# EAGLE schematic LED-Wiring (EAGLE 6.5.0)
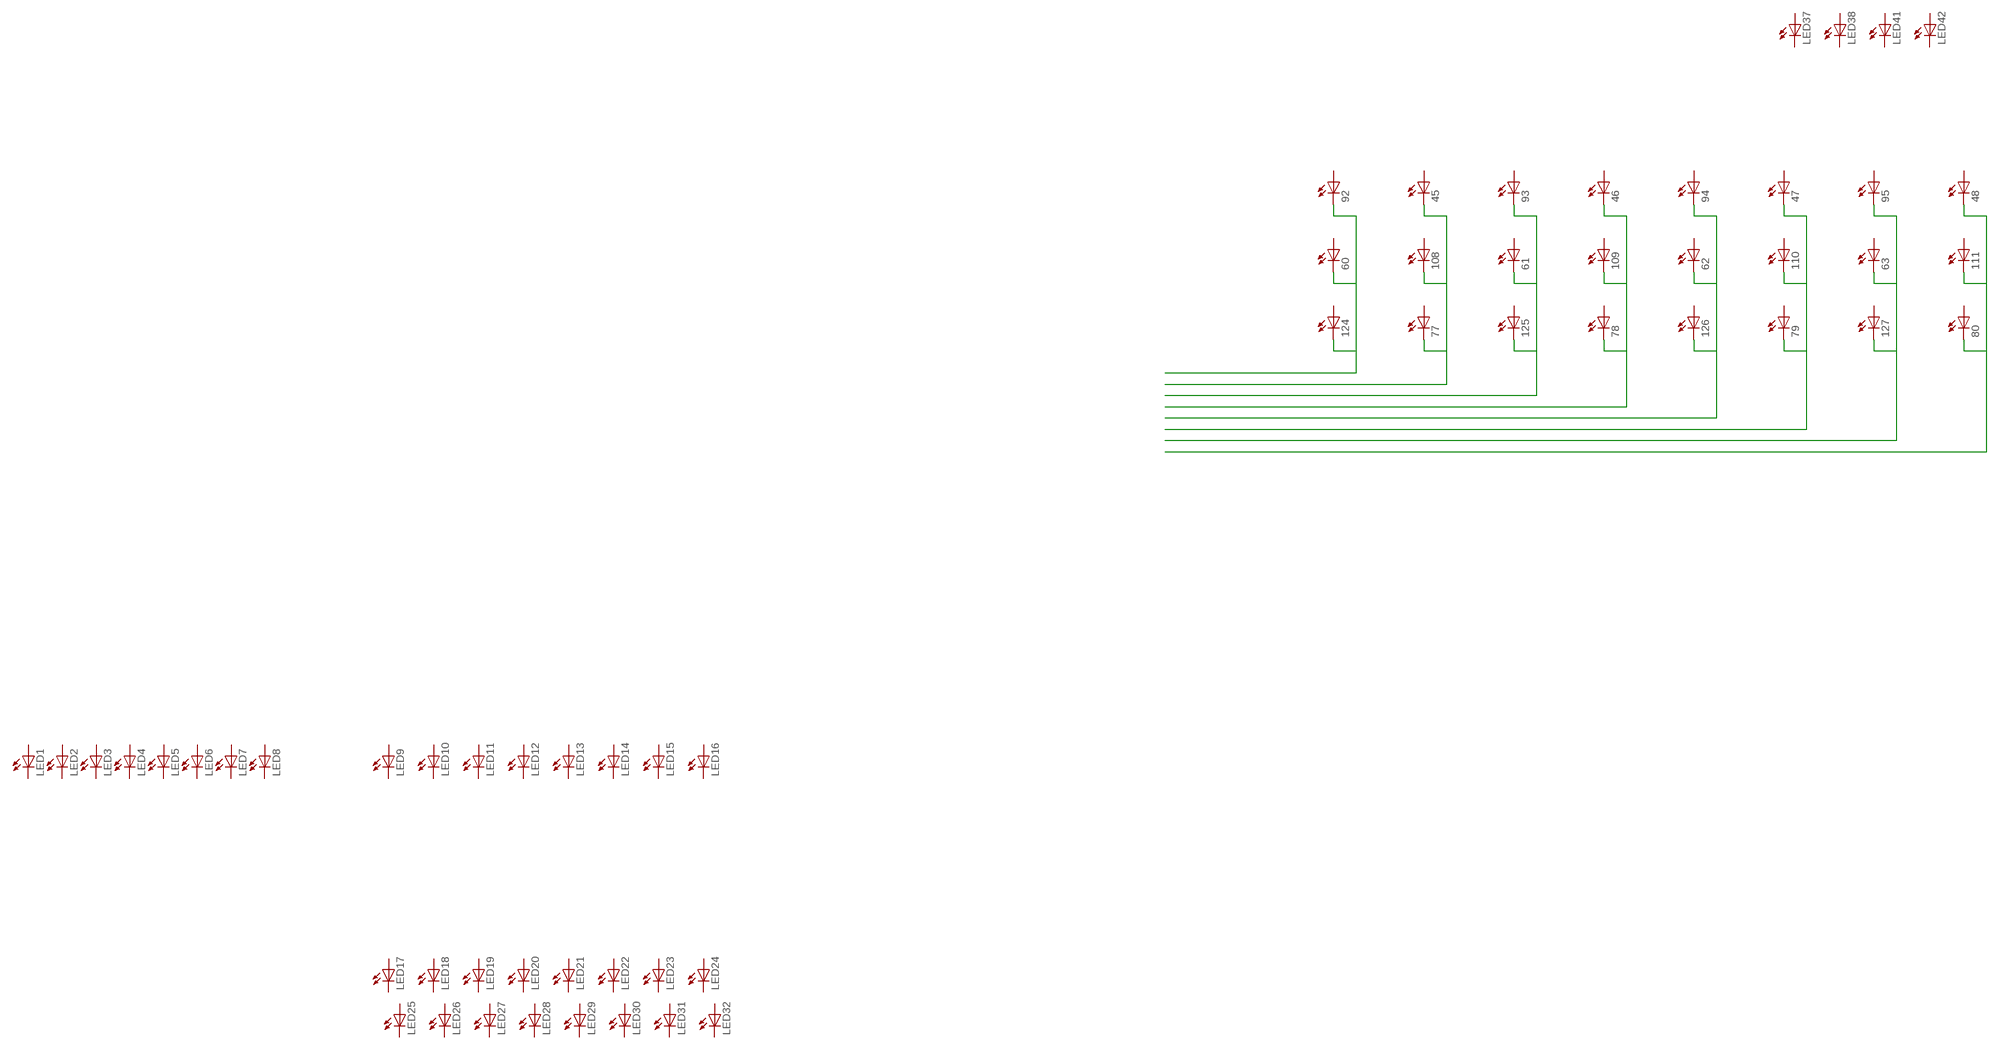
[diagram p0: schematic, sheet 1]

## Parts
45  LED  [SMARTLED-TTW]
46  LED  [SMARTLED-TTW]
47  LED  [SMARTLED-TTW]
48  LED  [SMARTLED-TTW]
60  LED  [SMARTLED-TTW]
61  LED  [SMARTLED-TTW]
62  LED  [SMARTLED-TTW]
63  LED  [SMARTLED-TTW]
77  LED  [SMARTLED-TTW]
78  LED  [SMARTLED-TTW]
79  LED  [SMARTLED-TTW]
80  LED  [SMARTLED-TTW]
92  LED  [SMARTLED-TTW]
93  LED  [SMARTLED-TTW]
94  LED  [SMARTLED-TTW]
95  LED  [SMARTLED-TTW]
108  LED  [SMARTLED-TTW]
109  LED  [SMARTLED-TTW]
110  LED  [SMARTLED-TTW]
111  LED  [SMARTLED-TTW]
124  LED  [SMARTLED-TTW]
125  LED  [SMARTLED-TTW]
126  LED  [SMARTLED-TTW]
127  LED  [SMARTLED-TTW]
LED1  LED  [SMARTLED-TTW]
LED2  LED  [SMARTLED-TTW]
LED3  LED  [SMARTLED-TTW]
LED4  LED  [SMARTLED-TTW]
LED5  LED  [SMARTLED-TTW]
LED6  LED  [SMARTLED-TTW]
LED7  LED  [SMARTLED-TTW]
LED8  LED  [SMARTLED-TTW]
LED9  LED  [SMARTLED-TTW]
LED10  LED  [SMARTLED-TTW]
LED11  LED  [SMARTLED-TTW]
LED12  LED  [SMARTLED-TTW]
LED13  LED  [SMARTLED-TTW]
LED14  LED  [SMARTLED-TTW]
LED15  LED  [SMARTLED-TTW]
LED16  LED  [SMARTLED-TTW]
LED17  LED  [SMARTLED-TTW]
LED18  LED  [SMARTLED-TTW]
LED19  LED  [SMARTLED-TTW]
LED20  LED  [SMARTLED-TTW]
LED21  LED  [SMARTLED-TTW]
LED22  LED  [SMARTLED-TTW]
LED23  LED  [SMARTLED-TTW]
LED24  LED  [SMARTLED-TTW]
LED25  LED  [SMARTLED-TTW]
LED26  LED  [SMARTLED-TTW]
LED27  LED  [SMARTLED-TTW]
LED28  LED  [SMARTLED-TTW]
LED29  LED  [SMARTLED-TTW]
LED30  LED  [SMARTLED-TTW]
LED31  LED  [SMARTLED-TTW]
LED32  LED  [SMARTLED-TTW]
LED37  LED  [SMARTLED-TTW]
LED38  LED  [SMARTLED-TTW]
LED41  LED  [SMARTLED-TTW]
LED42  LED  [SMARTLED-TTW]

## Nets
N$1: 60.C@1(C) 92.C@1(C) 124.C@1(C)
N$3: 45.C@1(C) 77.C@1(C) 108.C@1(C)
N$6: 61.C@1(C) 93.C@1(C) 125.C@1(C)
N$9: 46.C@1(C) 78.C@1(C) 109.C@1(C)
N$12: 62.C@1(C) 94.C@1(C) 126.C@1(C)
N$15: 47.C@1(C) 79.C@1(C) 110.C@1(C)
N$18: 63.C@1(C) 95.C@1(C) 127.C@1(C)
N$19: 48.C@1(C) 80.C@1(C) 111.C@1(C)
Unconnected: 45.A@1(A) 46.A@1(A) 47.A@1(A) 48.A@1(A) 60.A@1(A) 61.A@1(A) 62.A@1(A) 63.A@1(A) 77.A@1(A) 78.A@1(A) 79.A@1(A) 80.A@1(A) 92.A@1(A) 93.A@1(A) 94.A@1(A) 95.A@1(A) 108.A@1(A) 109.A@1(A) 110.A@1(A) 111.A@1(A) 124.A@1(A) 125.A@1(A) 126.A@1(A) 127.A@1(A) LED1.A@1(A) LED1.C@1(C) LED2.A@1(A) LED2.C@1(C) LED3.A@1(A) LED3.C@1(C) LED4.A@1(A) LED4.C@1(C) LED5.A@1(A) LED5.C@1(C) LED6.A@1(A) LED6.C@1(C) LED7.A@1(A) LED7.C@1(C) LED8.A@1(A) LED8.C@1(C) LED9.A@1(A) LED9.C@1(C) LED10.A@1(A) LED10.C@1(C) LED11.A@1(A) LED11.C@1(C) LED12.A@1(A) LED12.C@1(C) LED13.A@1(A) LED13.C@1(C) LED14.A@1(A) LED14.C@1(C) LED15.A@1(A) LED15.C@1(C) LED16.A@1(A) LED16.C@1(C) LED17.A@1(A) LED17.C@1(C) LED18.A@1(A) LED18.C@1(C) LED19.A@1(A) LED19.C@1(C) LED20.A@1(A) LED20.C@1(C) LED21.A@1(A) LED21.C@1(C) LED22.A@1(A) LED22.C@1(C) LED23.A@1(A) LED23.C@1(C) LED24.A@1(A) LED24.C@1(C) LED25.A@1(A) LED25.C@1(C) LED26.A@1(A) LED26.C@1(C) LED27.A@1(A) LED27.C@1(C) LED28.A@1(A) LED28.C@1(C) LED29.A@1(A) LED29.C@1(C) LED30.A@1(A) LED30.C@1(C) LED31.A@1(A) LED31.C@1(C) LED32.A@1(A) LED32.C@1(C) LED37.A@1(A) LED37.C@1(C) LED38.A@1(A) LED38.C@1(C) LED41.A@1(A) LED41.C@1(C) LED42.A@1(A) LED42.C@1(C)

## Library data of the parts
45-48 60-63 77-80 92-95 108-111 124-127 LED1-LED32 LED37 LED38 LED41 LED42 = adafruit:LED: LED OSRAM: - CHIPLED LG R971, LG N971, LY N971, LG Q971, LY Q971, LO R971, LY R971 LH N974, LH R974 LS Q976, LO Q976, LY Q976 LO Q996 - Hyper CHIPLED LW Q18S LB Q993, LB Q99A, LB R99A - SideLED LS A670, LO A670, LY A670, LG A670, LP A670 LB A673, LV A673, LT A673, LW A673 LH A674 LY A675 LS A676, LA A676, LO A676, LY A676, LW A676 LS A679, LY A679, LG A679 - Hyper Micro SIDELED® LS Y876, LA Y876, LO Y876, LY Y876 LT Y87S - SmartLED LW L88C, LW L88S LB L89C, LB L89S, LG L890 LS L89K, LO L89K, LY L89K LS L896, LA L896, LO L896, LY L896 - TOPLED LS T670, LO T670, LY T670, LG T670, LP T670 LSG T670, LSP T670, LSY T670, LOP T670, LYG T670 LG T671, LOG T671, LSG T671 LB T673, LV T673, LT T673, LW T673 LH T674 LS T676, LA T676, LO T676, LY T676, LB T676, LH T676, LSB T676, LW T676 LB T67C, LV T67C, LT T67C, LS T67K, LO T67K, LY T67K, LW E67C LS E67B, LA E67B, LO E67B, LY E67B, LB E67C, LV E67C, LT E67C LW T67C LS T679, LY T679, LG T679 LS T770, LO T770, LY T770, LG T770, LP T770 LB T773, LV T773, LT T773, LW T773 LH T774 LS E675, LA E675, LY E675, LS T675 LS T776, LA T776, LO T776, LY T776, LB T776 LHGB T686 LT T68C, LB T68C - Hyper Mini TOPLED® LB M676 - Mini TOPLED Santana® LG M470 LS M47K, LO M47K, LY M47K Source: http://www.osram.convergy.de/